# EAGLE design filter (EAGLE 9.5.2)
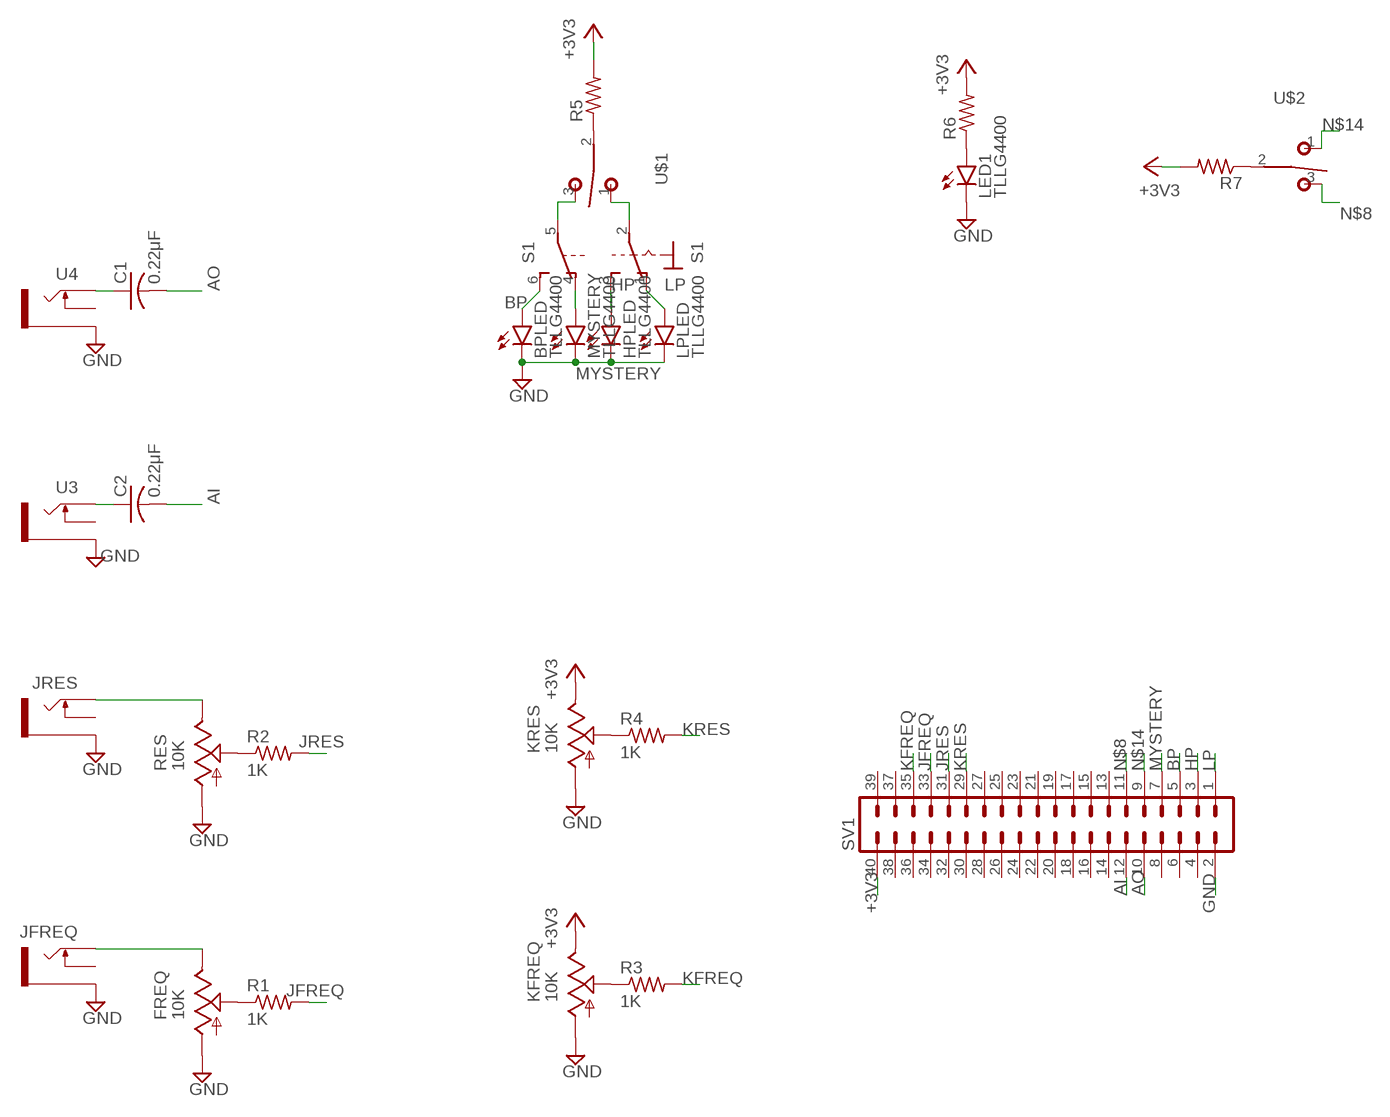
[diagram p0: schematic, sheet 1]

## Parts
BPLED  TLLG4400  [LED3MM]
C1  0.22μF  C-US025-024X044  [C025-024X044]
C2  0.22μF  C-US025-024X044  [C025-024X044]
FREQ  10K  9MM_SNAP-IN_POT_  [9MM_SNAP-IN_POT]
HPLED  TLLG4400  [LED3MM]
JFREQ  THONKICONNNEW  [WQP-PJ301M-12_JACK]
JRES  THONKICONNNEW  [WQP-PJ301M-12_JACK]
KFREQ  10K  9MM_SNAP-IN_POT_  [9MM_SNAP-IN_POT]
KRES  10K  9MM_SNAP-IN_POT_  [9MM_SNAP-IN_POT]
LED1  TLLG4400  [LED3MM]
LPLED  TLLG4400  [LED3MM]
MYSTERY  TLLG4400  [LED3MM]
R1  1K  R-US_0207/10  [0207/10]
R2  1K  R-US_0207/10  [0207/10]
R3  1K  R-US_0207/10  [0207/10]
R4  1K  R-US_0207/10  [0207/10]
R5  R-US_0207/10  [0207/10]
R6  R-US_0207/10  [0207/10]
R7  R-US_0207/10  [0207/10]
RES  10K  9MM_SNAP-IN_POT_  [9MM_SNAP-IN_POT]
S1  320-938  [320-938]
SV1  MA20-2  [MA20-2]
U3  THONKICONNNEW  [WQP-PJ301M-12_JACK]
U4  THONKICONNNEW  [WQP-PJ301M-12_JACK]
U$1  T-80-T-SPDT-ON-OFF-ON  [M9040P]
U$2  T-80-T-SPDT-ON-OFF-ON  [M9040P]

## Nets
+3V3: KFREQ.3(E) KRES.3(E) R5.2 R6.2 R7.2 SV1.40
AI: C2.2 SV1.12
AO: C1.2 SV1.10
BP: BPLED.A S1.6(B:S) SV1.5
GND: BPLED.K(C) FREQ.1(A) HPLED.K(C) JFREQ.P$3_SLEEVE(SLEEVE) JRES.P$3_SLEEVE(SLEEVE) KFREQ.1(A) KRES.1(A) LED1.K(C) LPLED.K(C) MYSTERY.K(C) RES.1(A) SV1.2 U3.P$3_SLEEVE(SLEEVE) U4.P$3_SLEEVE(SLEEVE)
HP: HPLED.A S1.3(1:S) SV1.3
JFREQ: R1.2 SV1.33
JRES: R2.2 SV1.31
KFREQ: R3.2 SV1.35
KRES: R4.2 SV1.29
LP: LPLED.A S1.1(1:O) SV1.1
MYSTERY: MYSTERY.A S1.4(B:O) SV1.7
N$1: FREQ.2(S) R1.1
N$2: R2.1 RES.2(S)
N$3: KFREQ.2(S) R3.1
N$4: KRES.2(S) R4.1
N$5: C1.1 U4.P$1_TIP(TIP)
N$6: LED1.A R6.1
N$7: C2.1 U3.P$1_TIP(TIP)
N$8: SV1.11 U$2.3(S)
N$9: JRES.P$1_TIP(TIP) RES.3(E)
N$10: FREQ.3(E) JFREQ.P$1_TIP(TIP)
N$11: S1.5(B:P) U$1.3(S)
N$12: S1.2(1:P) U$1.1(O)
N$13: R5.1 U$1.2(P)
N$14: SV1.9 U$2.1(O)
N$15: R7.1 U$2.2(P)
Unconnected: JFREQ.P$2_SWITCH(SWITCH) JRES.P$2_SWITCH(SWITCH) SV1.4 SV1.6 SV1.8 SV1.13 SV1.14 SV1.15 SV1.16 SV1.17 SV1.18 SV1.19 SV1.20 SV1.21 SV1.22 SV1.23 SV1.24 SV1.25 SV1.26 SV1.27 SV1.28 SV1.30 SV1.32 SV1.34 SV1.36 SV1.37 SV1.38 SV1.39 U3.P$2_SWITCH(SWITCH) U4.P$2_SWITCH(SWITCH)

## Library data of the parts
BPLED HPLED LED1 LPLED MYSTERY = led:TLLG4400: Low Current (2mA) LED 3 mm Tinted Diffused Package color GREEN Source: Data sheet <http://www.farnell.com/datasheets/391098.pdf>; MF: VISHAY SEMICONDUCTOR; OC_FARNELL: 1612435
C1 C2 = rcl:C-US: CAPACITOR, American symbol; SPICEPREFIX: C
FREQ KFREQ KRES RES = MusicThingModular:9MM_SNAP-IN_POT: 9mm vertical snap-in pot, Alpha / Panasonic style
JFREQ JRES U3 U4 = MusicThingModular:THONKICONN: 3.5mm socket for Eurorack modular synths
R1-R7 = rcl:R-US_: RESISTOR, American symbol; SPICEPREFIX: R
S1 = switch2:320-938: TOGGLE SWITCH distributor RS Components
SV1 = con-lstb:MA20-2: PIN HEADER; OC_FARNELL: unknown; OC_NEWARK: unknown
U$1 U$2 = MusicThingModular:T-80-T-SPDT-ON-OFF-ON

## Board
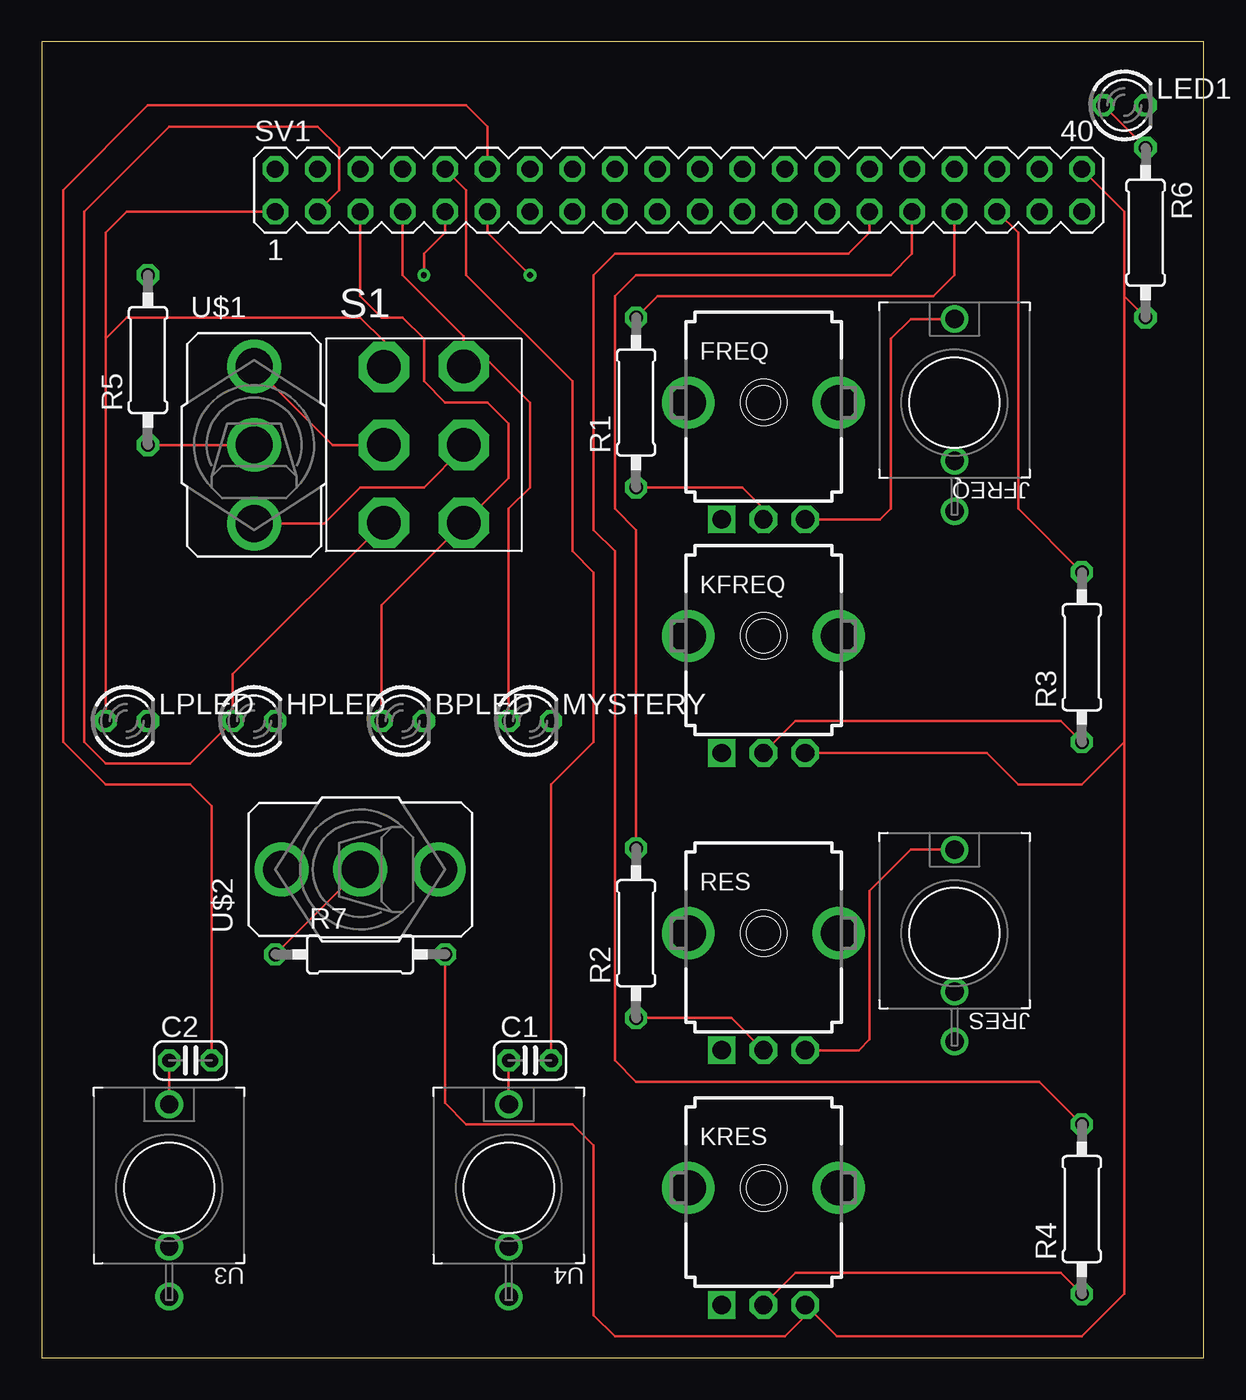
[diagram p1: board, top side]
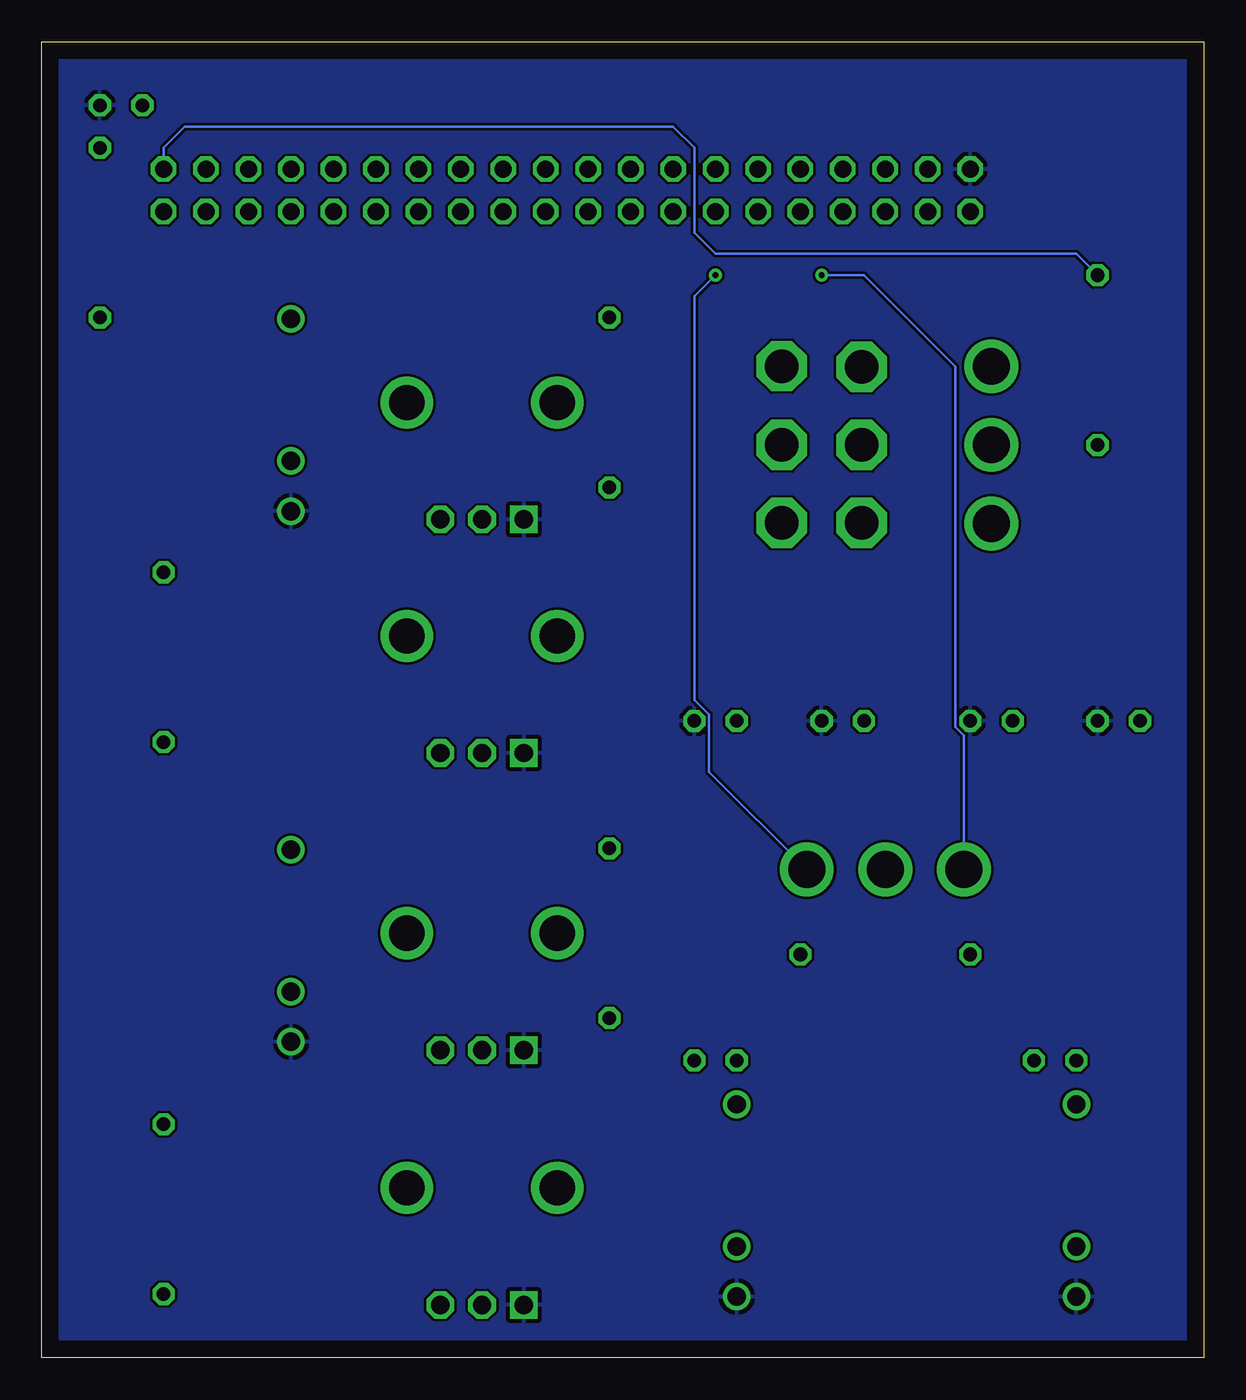
[diagram p2: board, bottom side, seen from below]

Size 69.52 x 78.73 mm. Coordinates in mm from the lower left corner, seen from the top.
Outline: 0,0 69.52,0 69.52,78.73 0,78.73 0,0
Copper layers (1*16): Top 0.035mm / dielectric 1.5mm / Bottom 0.035mm
Design rules "default": minimum track width 6mil, minimum drill 0.35mm, track to track 6mil, track to pad 6mil, pad to pad 6mil, via to via 6mil, smd to smd 6mil, copper to edge 40mil, drill to drill 6mil, minimum pad ring 10mil, minimum via ring 8mil, stop-mask expansion 4mil, vias tented up to drill 0mil, thermal gap 10mil

### Footprints (pad centres in the part's own frame; a part is rotated, then mirrored left to right if it is on the bottom)
LED3MM = drill 0.813 octagon: A -1.27,0; K 1.27,0
C025-024X044 = drill 0.813 octagon: 1 -1.27,0; 2 1.27,0
9MM_SNAP-IN_POT = drill 1.1 square: 1 -2.5,-7 | drill 1.1 octagon: 2 0,-7; 3 2.5,-7 | drill 2.1 pad 2.794: CHASSIS1 -4.5,0; CHASSIS2 4.5,0
WQP-PJ301M-12_JACK = drill 1.1: P$1_TIP 0,5; P$2_SWITCH 0,-3.5; P$3_SLEEVE 0,-6.5
0207/10 = drill 0.813 octagon: 1 -5.08,0; 2 5.08,0
320-938 = drill 2.007 octagon: 1 -2.388,4.663; 2 -2.388,0; 3 -2.388,-4.663; 4 2.388,4.713; 5 2.388,0; 6 2.388,-4.663
MA20-2 = drill 1.016 octagon: 1 -24.13,-1.27; 2 -24.13,1.27; 3 -21.59,-1.27; 4 -21.59,1.27; 5 -19.05,-1.27; 6 -19.05,1.27; 7 -16.51,-1.27; 8 -16.51,1.27; 9 -13.97,-1.27; 10 -13.97,1.27; 11 -11.43,-1.27; 12 -11.43,1.27; 13 -8.89,-1.27; 14 -8.89,1.27; 15 -6.35,-1.27; 16 -6.35,1.27; 17 -3.81,-1.27; 18 -3.81,1.27; 19 -1.27,-1.27; 20 -1.27,1.27; 21 1.27,-1.27; 22 1.27,1.27; 23 3.81,-1.27; 24 3.81,1.27; 25 6.35,-1.27; 26 6.35,1.27; 27 8.89,-1.27; 28 8.89,1.27; 29 11.43,-1.27; 30 11.43,1.27; 31 13.97,-1.27; 32 13.97,1.27; 33 16.51,-1.27; 34 16.51,1.27; 35 19.05,-1.27; 36 19.05,1.27; 37 21.59,-1.27; 38 21.59,1.27; 39 24.13,-1.27; 40 24.13,1.27
M9040P = drill 2.2: 1 0,4.699 | drill 2.2 pad 3: 2 0,0; 3 0,-4.699

### Placement (x,y rotation side)
BPLED  21.59,38.1 0 top
C1  29.21,17.78 0 top
C2  8.89,17.78 0 top
FREQ  43.18,57.15 0 top
HPLED  12.7,38.1 0 top
JFREQ  54.61,57.15 0 top
JRES  54.61,25.4 0 top
KFREQ  43.18,43.18 0 top
KRES  43.18,10.16 0 top
LED1  64.77,74.93 0 top
LPLED  5.08,38.1 0 top
MYSTERY  29.21,38.1 0 top
R1  35.56,57.15 90 top
R2  35.56,25.4 90 top
R3  62.23,41.91 90 top
R4  62.23,8.89 90 top
R5  6.35,59.69 90 top
R6  66.04,67.31 270 top
R7  19.05,24.13 0 top
RES  43.18,25.4 0 top
S1  22.86,54.61 0 top
SV1  38.1,69.85 0 top
U3  7.62,10.16 0 top
U4  27.94,10.16 0 top
U$1  12.7,54.61 0 top
U$2  19.05,29.21 90 top

### Tracks (layer width: path | path; a pad name or v marks a point on that pad's centre or on a via)
+3V3
  Top 0.152: SV1.40 64.77,68.58 64.77,63.5 | 64.77,63.5 64.77,36.83 | 64.77,36.83 62.23,34.29 58.42,34.29 56.53,36.18 KFREQ.3 | 64.77,36.83 64.77,3.81 62.23,1.27 47.57,1.27 KRES.3 45.68,2.5 44.45,1.27 34.29,1.27 33.02,2.54 33.02,12.7 31.75,13.97 25.4,13.97 24.13,15.24 R7.2 | R6.2 64.77,63.5
  Bottom 0.152: R5.2 7.62,66.04 29.21,66.04 30.48,67.31 30.48,72.39 31.75,73.66 60.96,73.66 62.23,72.39 SV1.40
AI
  Top 0.152: C2.2 10.16,33.02 8.89,34.29 3.81,34.29 1.27,36.83 1.27,69.85 6.35,74.93 25.4,74.93 26.67,73.66 SV1.12
AO
  Top 0.152: C1.2 30.48,34.29 33.02,36.83 33.02,46.99 31.75,48.26 31.75,58.42 25.4,64.77 25.4,69.85 SV1.10
BP
  Top 0.152: BPLED.A 20.32,45.02 S1.6 27.94,52.64 27.94,55.88 26.67,57.15 24.13,57.15 22.86,58.42 22.86,60.96 21.59,62.23 20.32,62.23 19.05,63.5 SV1.5
GND
  pour Bottom: 0,78.74 69.85,78.74 69.85,0 0,0
HP
  Top 0.152: SV1.3 17.78,69.85 17.78,72.39 16.51,73.66 7.62,73.66 2.54,68.58 2.54,36.83 3.81,35.56 8.89,35.56 HPLED.A 11.43,40.9 S1.3
JFREQ
  Top 0.152: R1.2 36.83,63.5 53.34,63.5 54.61,64.77 SV1.33
JRES
  Top 0.152: R2.2 35.56,49.53 34.29,50.8 34.29,63.5 35.56,64.77 50.8,64.77 52.07,66.04 SV1.31
KFREQ
  Top 0.152: R3.2 58.42,50.8 58.42,67.31 SV1.35
KRES
  Top 0.152: R4.2 59.69,16.51 35.56,16.51 34.29,17.78 34.29,48.26 33.02,49.53 33.02,64.77 34.29,66.04 48.26,66.04 49.53,67.31 SV1.29
LP
  Top 0.152: LPLED.A 3.81,60.96 | 3.81,60.96 3.81,67.31 5.08,68.58 SV1.1 | S1.1 20.47,60.81 19.05,62.23 5.08,62.23 3.81,60.96
MYSTERY
  Top 0.152: S1.4 25.25,59.69 | 25.25,59.69 25.25,61.11 21.59,64.77 SV1.7 | 25.25,59.69 26.67,59.69 29.21,57.15 29.21,52.07 27.94,50.8 MYSTERY.A
N$1
  Top 0.152: R1.1 41.91,52.07 43.18,50.8 FREQ.2
N$2
  Top 0.152: RES.2 41.26,20.32 R2.1
N$3
  Top 0.152: KFREQ.2 45.1,38.1 60.96,38.1 R3.1
N$4
  Top 0.152: R4.1 60.96,5.08 45.1,5.08 KRES.2
N$5
  Top 0.152: C1.1 U4.P$1_TIP
N$6
  Top 0.152: LED1.A R6.1
N$7
  Top 0.152: U3.P$1_TIP C2.1
N$8  (via drill 0.35)
  Top 0.152: v29.21,64.77 26.67,67.31 SV1.11
  Bottom 0.152: U$2.3 29.59,35.05 29.59,38.47 30.48,39.36 30.48,63.5 v29.21,64.77
N$9
  Top 0.152: JRES.P$1_TIP 51.99,30.4 49.53,27.94 49.53,19.05 48.88,18.4 RES.3
N$10
  Top 0.152: JFREQ.P$1_TIP 51.99,62.15 50.8,60.96 50.8,50.8 50.15,50.15 FREQ.3
N$11
  Top 0.152: U$1.3 16.89,49.91 19.05,52.07 22.86,52.07 25.25,54.46 S1.5
N$12
  Top 0.152: U$1.1 17.4,54.61 S1.2
N$13
  Top 0.152: R5.1 U$1.2
N$14  (via drill 0.35)
  Top 0.152: v22.86,64.77 22.86,66.04 24.13,67.31 SV1.9
  Bottom 0.152: U$2.1 14.35,37.22 14.86,37.73 14.86,59.31 20.32,64.77 v22.86,64.77
N$15
  Top 0.152: U$2.2 R7.1